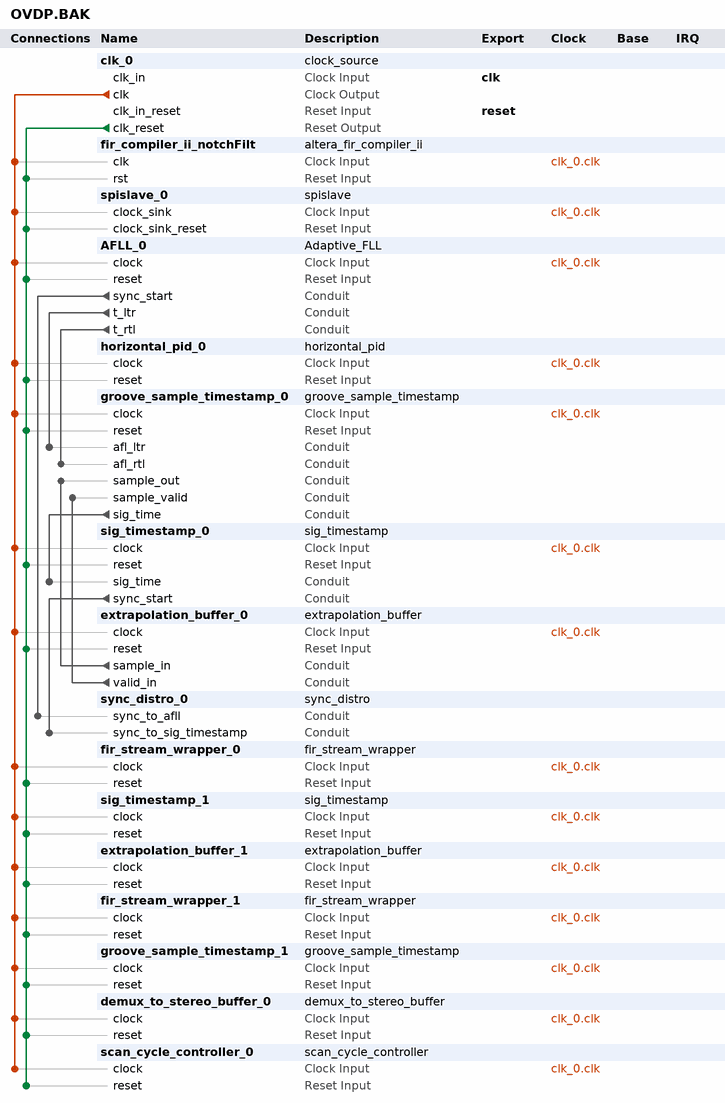
[diagram p0: system contents]
# Platform Designer (Qsys) system OVDP.BAK, MAX 10 10M50DAF484C7G
# Parameters at their usual value, and those the tool derives, are not listed.
package require -exact qsys 20.1
create_system OVDP.BAK
set_project_property DEVICE_FAMILY {MAX 10}
set_project_property DEVICE 10M50DAF484C7G

add_instance clk_0 clock_source 20.1
set_instance_parameter_value clk_0 clockFrequency 50000000

add_instance fir_compiler_ii_notchFilt altera_fir_compiler_ii 20.1
set_instance_parameter_value fir_compiler_ii_notchFilt coeffBitWidth 16
set_instance_parameter_value fir_compiler_ii_notchFilt coeffFracBitWidth 0
set_instance_parameter_value fir_compiler_ii_notchFilt coeffReload false
set_instance_parameter_value fir_compiler_ii_notchFilt coeffType int
set_instance_parameter_value fir_compiler_ii_notchFilt inputBitWidth 16
set_instance_parameter_value fir_compiler_ii_notchFilt inputChannelNum 1
set_instance_parameter_value fir_compiler_ii_notchFilt inputFracBitWidth 0
set_instance_parameter_value fir_compiler_ii_notchFilt inputRate 100
set_instance_parameter_value fir_compiler_ii_notchFilt inputType int
set_instance_parameter_value fir_compiler_ii_notchFilt outLsbBitRem 14
set_instance_parameter_value fir_compiler_ii_notchFilt outMsbBitRem 0
set_instance_parameter_value fir_compiler_ii_notchFilt outType int
set_instance_parameter_value fir_compiler_ii_notchFilt readWriteMode read_write
set_instance_parameter_value fir_compiler_ii_notchFilt speedGrade fast

add_instance spislave_0 spislave 20.1
set_instance_parameter_value spislave_0 SYNC_DEPTH 3

add_instance AFLL_0 Adaptive_FLL 1.0
set_instance_parameter_value AFLL_0 THRESHOLD 5000

add_instance horizontal_pid_0 horizontal_pid 1.0

add_instance groove_sample_timestamp_0 groove_sample_timestamp 1.0

add_instance sig_timestamp_0 sig_timestamp 1.0

add_instance extrapolation_buffer_0 extrapolation_buffer 1.0
set_instance_parameter_value extrapolation_buffer_0 N 8

add_instance sync_distro_0 sync_distro 1.0

add_instance fir_stream_wrapper_0 fir_stream_wrapper 1.0

add_instance sig_timestamp_1 sig_timestamp 1.0

add_instance extrapolation_buffer_1 extrapolation_buffer 1.0
set_instance_parameter_value extrapolation_buffer_1 N 8

add_instance fir_stream_wrapper_1 fir_stream_wrapper 1.0

add_instance groove_sample_timestamp_1 groove_sample_timestamp 1.0

add_instance demux_to_stereo_buffer_0 demux_to_stereo_buffer 1.0

add_instance scan_cycle_controller_0 scan_cycle_controller 1.0
set_instance_parameter_value scan_cycle_controller_0 COMPLETE 3
set_instance_parameter_value scan_cycle_controller_0 IDLE 0
set_instance_parameter_value scan_cycle_controller_0 WAIT_L 1
set_instance_parameter_value scan_cycle_controller_0 WAIT_R 2

# connections
add_connection clk_0.clk AFLL_0.clock clock
add_connection clk_0.clk demux_to_stereo_buffer_0.clock clock
add_connection clk_0.clk extrapolation_buffer_0.clock clock
add_connection clk_0.clk extrapolation_buffer_1.clock clock
add_connection clk_0.clk fir_compiler_ii_notchFilt.clk clock
add_connection clk_0.clk fir_stream_wrapper_0.clock clock
add_connection clk_0.clk fir_stream_wrapper_1.clock clock
add_connection clk_0.clk groove_sample_timestamp_0.clock clock
add_connection clk_0.clk groove_sample_timestamp_1.clock clock
add_connection clk_0.clk horizontal_pid_0.clock clock
add_connection clk_0.clk scan_cycle_controller_0.clock clock
add_connection clk_0.clk sig_timestamp_0.clock clock
add_connection clk_0.clk sig_timestamp_1.clock clock
add_connection clk_0.clk spislave_0.clock_sink clock
add_connection clk_0.clk_reset AFLL_0.reset reset
add_connection clk_0.clk_reset demux_to_stereo_buffer_0.reset reset
add_connection clk_0.clk_reset extrapolation_buffer_0.reset reset
add_connection clk_0.clk_reset extrapolation_buffer_1.reset reset
add_connection clk_0.clk_reset fir_compiler_ii_notchFilt.rst reset
add_connection clk_0.clk_reset fir_stream_wrapper_0.reset reset
add_connection clk_0.clk_reset fir_stream_wrapper_1.reset reset
add_connection clk_0.clk_reset groove_sample_timestamp_0.reset reset
add_connection clk_0.clk_reset groove_sample_timestamp_1.reset reset
add_connection clk_0.clk_reset horizontal_pid_0.reset reset
add_connection clk_0.clk_reset scan_cycle_controller_0.reset reset
add_connection clk_0.clk_reset sig_timestamp_0.reset reset
add_connection clk_0.clk_reset sig_timestamp_1.reset reset
add_connection clk_0.clk_reset spislave_0.clock_sink_reset reset
add_connection AFLL_0.sync_start sync_distro_0.sync_to_afll conduit
add_connection AFLL_0.t_ltr groove_sample_timestamp_0.afl_ltr conduit
add_connection AFLL_0.t_rtl groove_sample_timestamp_0.afl_rtl conduit
add_connection extrapolation_buffer_0.sample_in groove_sample_timestamp_0.sample_out conduit
add_connection extrapolation_buffer_0.valid_in groove_sample_timestamp_0.sample_valid conduit
add_connection groove_sample_timestamp_0.sig_time sig_timestamp_0.sig_time conduit
add_connection sig_timestamp_0.sync_start sync_distro_0.sync_to_sig_timestamp conduit

# exported interfaces
add_interface clk clock sink
set_interface_property clk EXPORT_OF clk_0.clk_in
add_interface reset reset sink
set_interface_property reset EXPORT_OF clk_0.clk_in_reset

set_interconnect_requirement {$system} qsys_mm.clockCrossingAdapter HANDSHAKE
set_interconnect_requirement {$system} qsys_mm.enableEccProtection FALSE
set_interconnect_requirement {$system} qsys_mm.insertDefaultSlave FALSE
set_interconnect_requirement {$system} qsys_mm.maxAdditionalLatency 1

save_system OVDP.BAK.qsys
